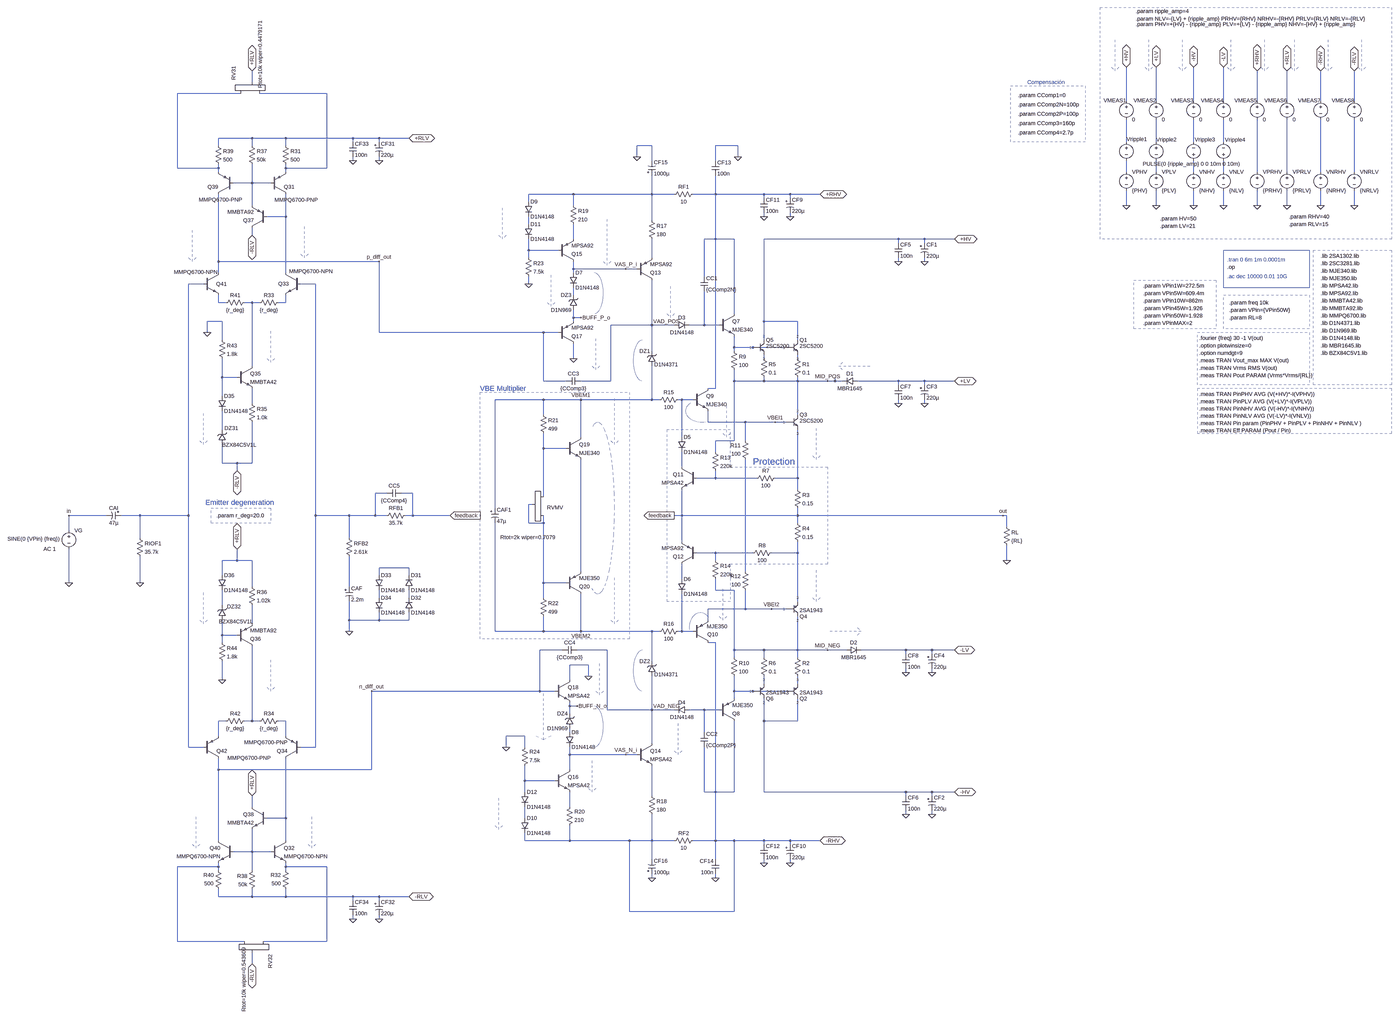
[diagram p0: schematic amplifier_V0.6 - Copy (2).asc, whole sheet]
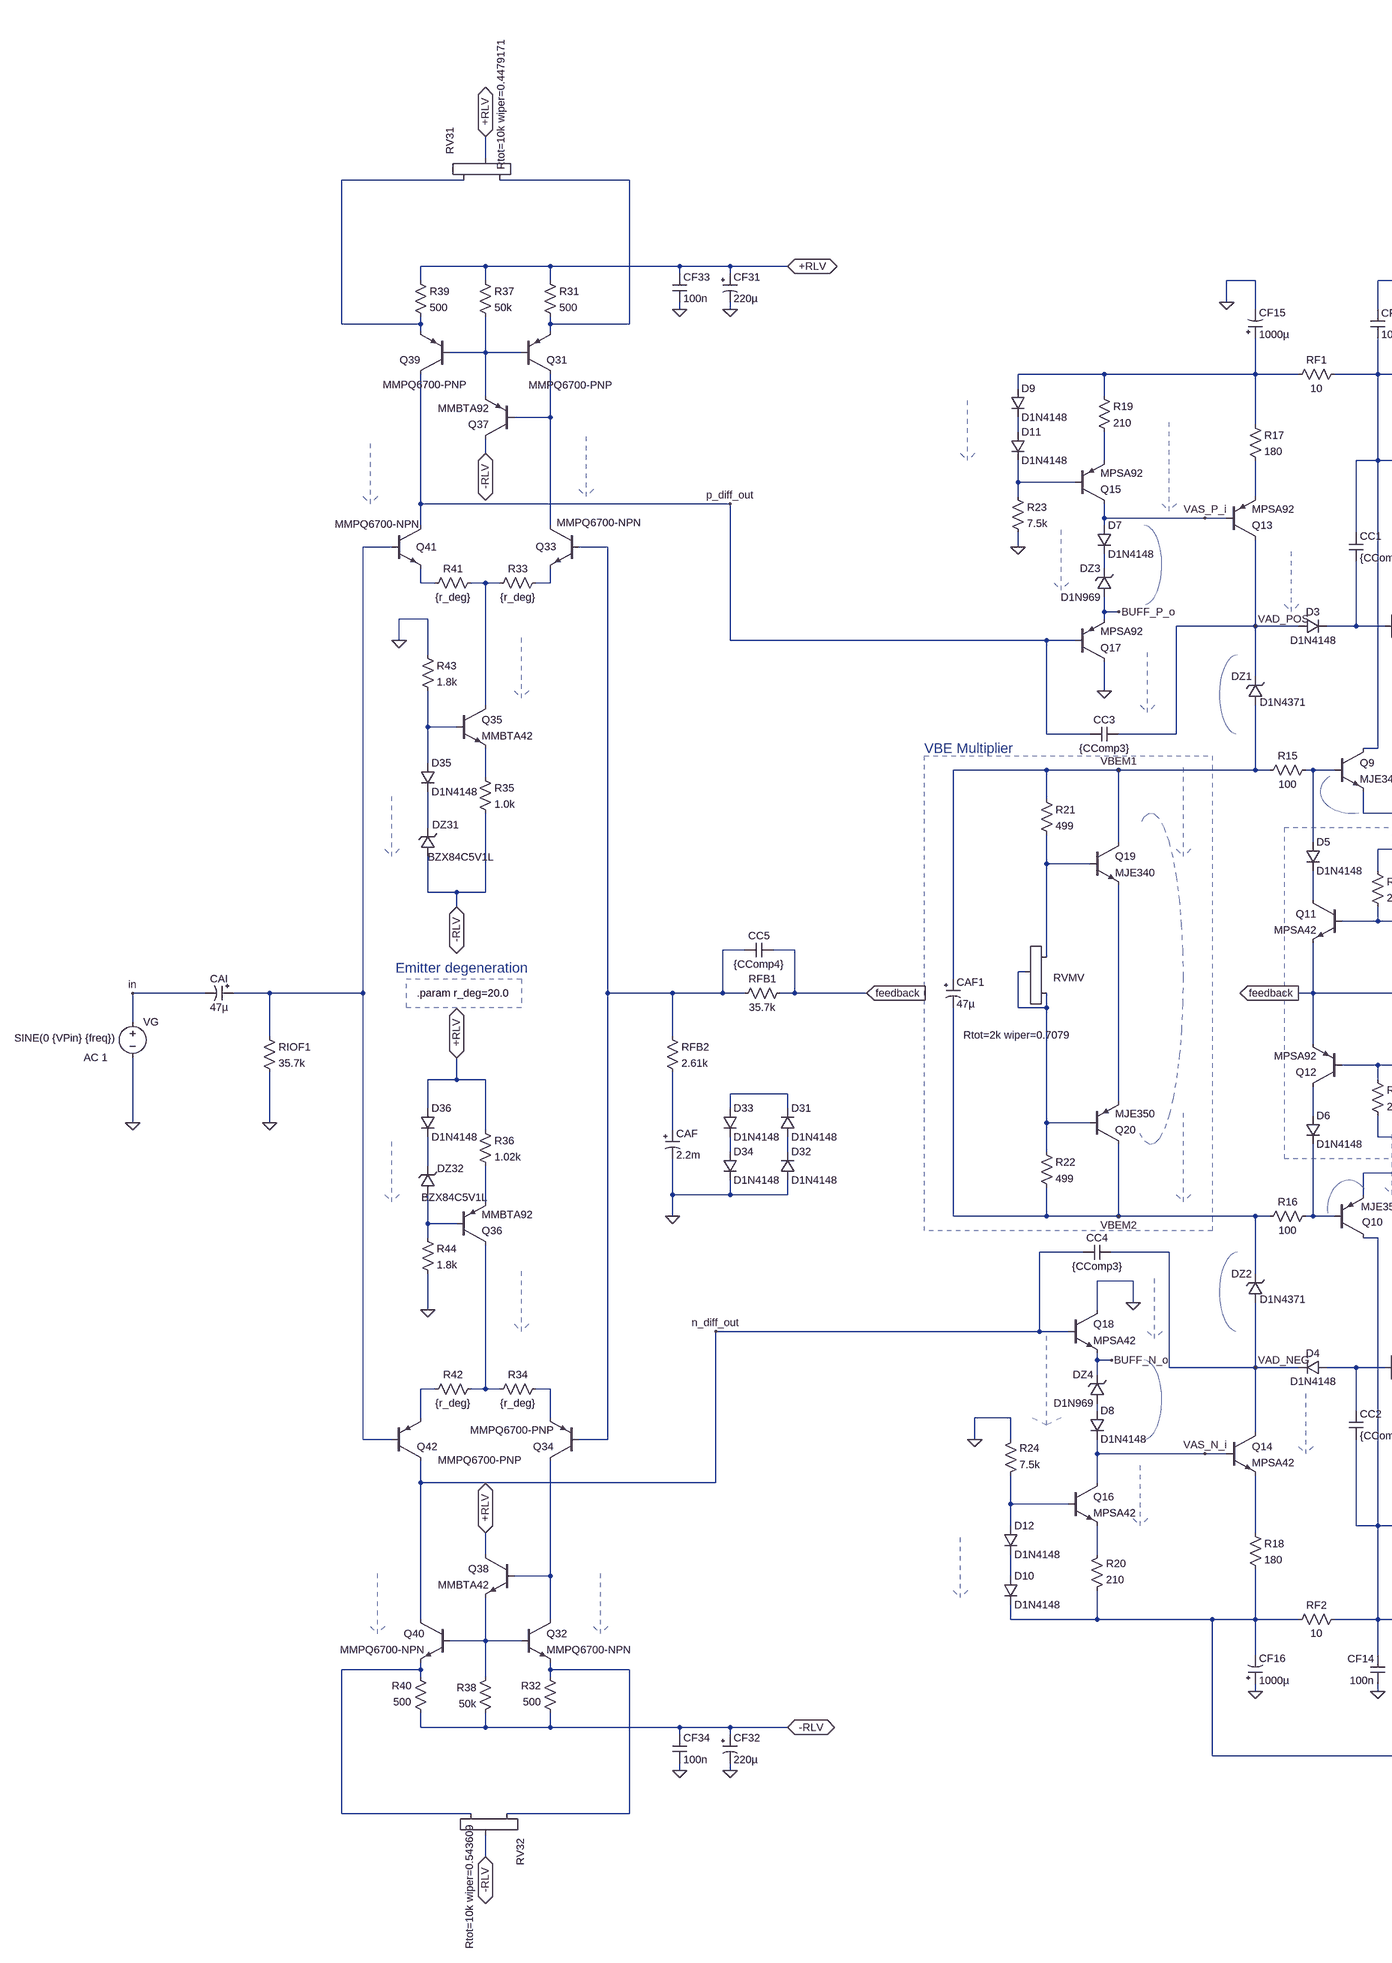
[diagram p1: schematic amplifier_V0.6 - Copy (2).asc, part, row 1 of 1, column 1 of 2]
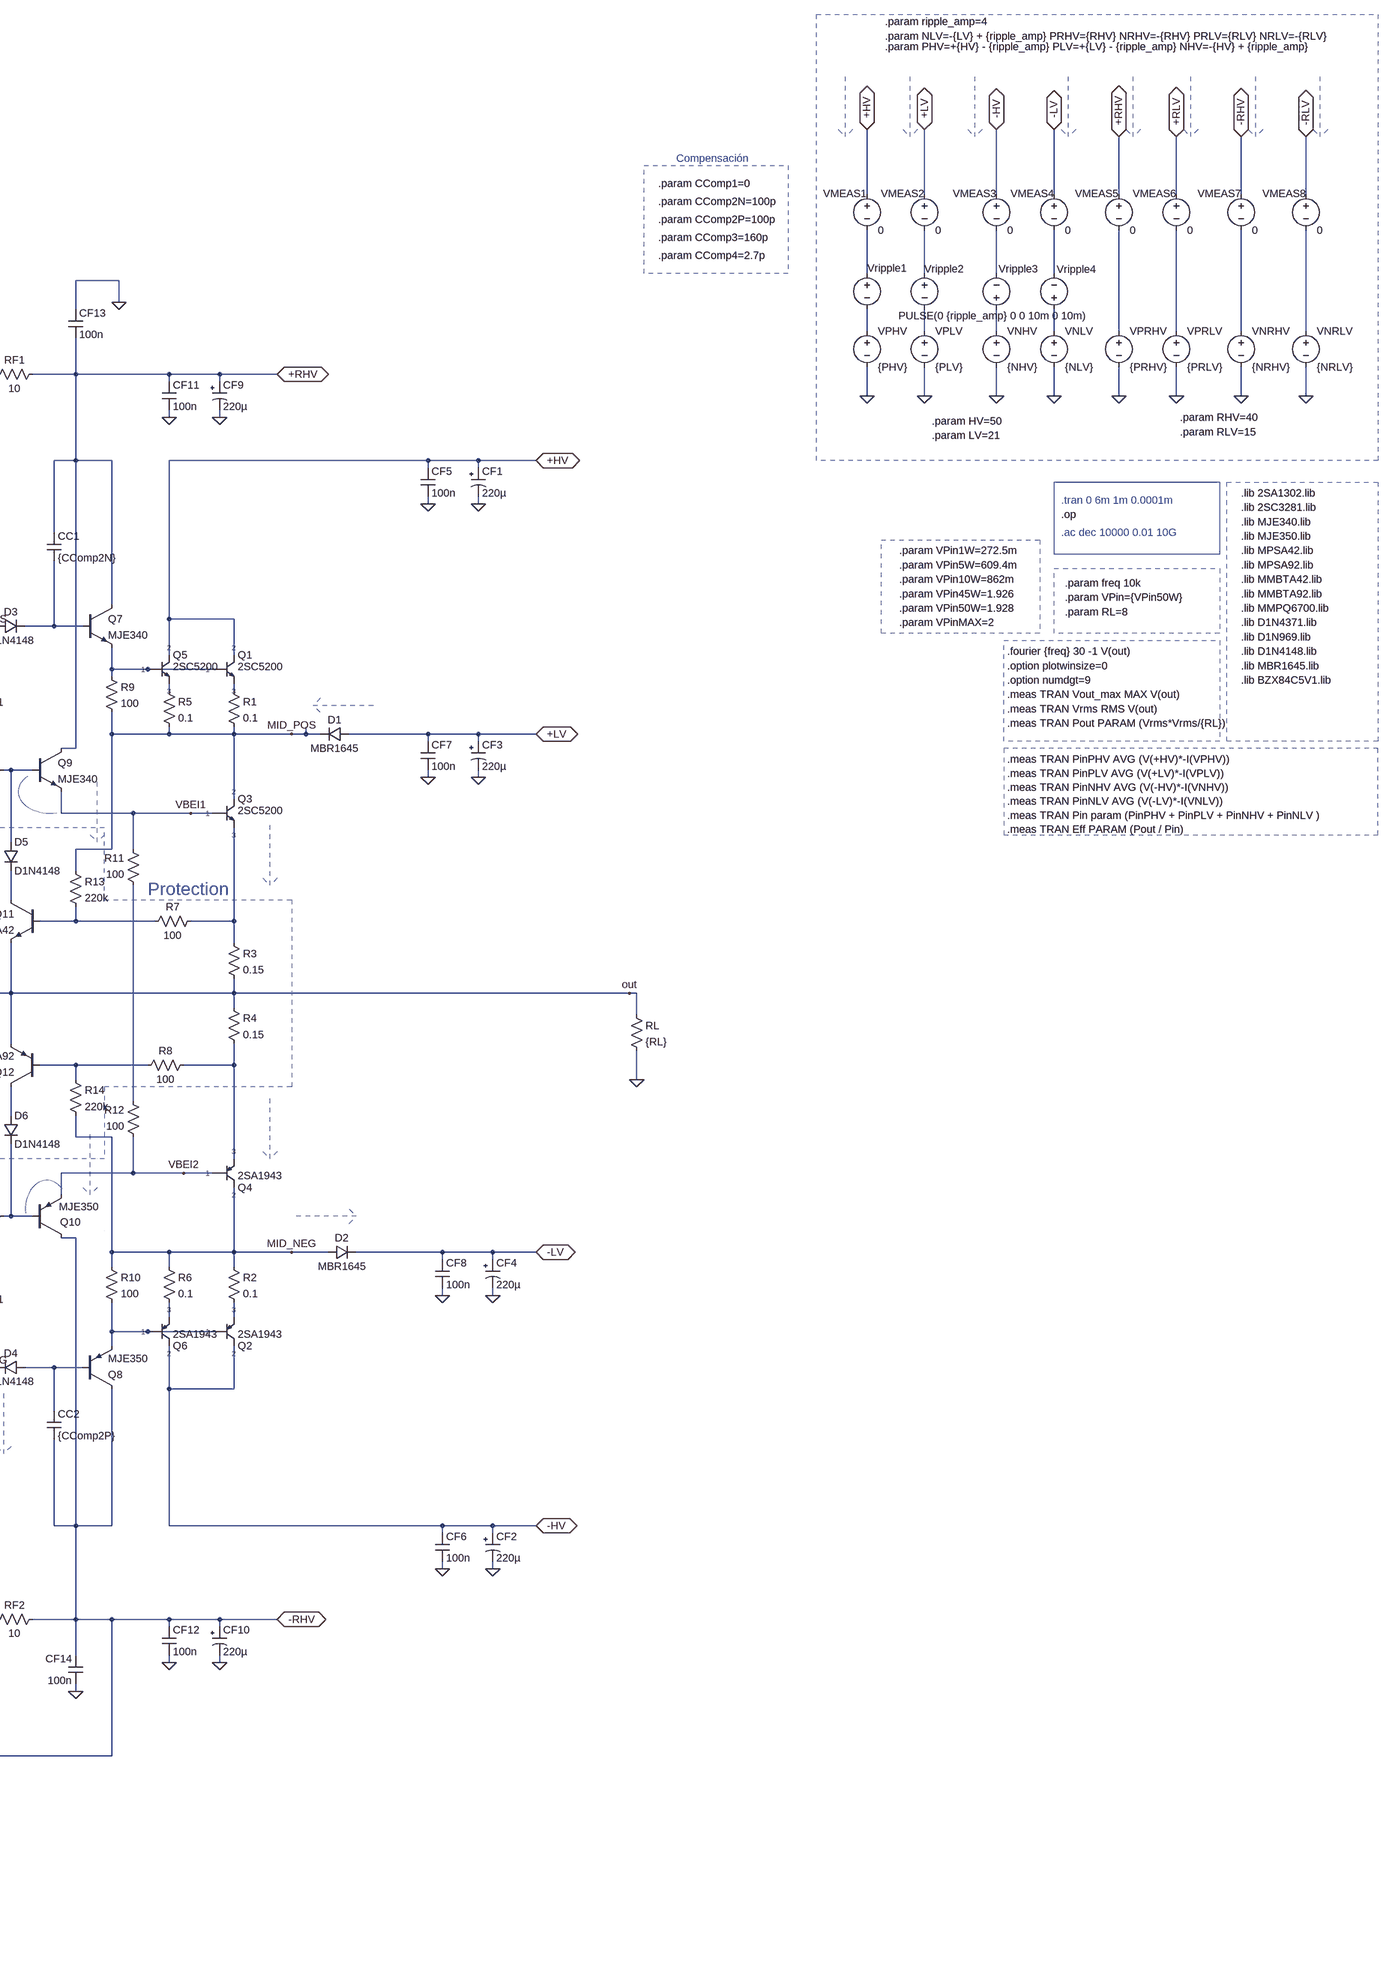
[diagram p2: schematic amplifier_V0.6 - Copy (2).asc, part, row 1 of 1, column 2 of 2]
amplifier_V0.6 - Copy (2).asc, the LTspice schematic file:
Version 4
SHEET 1 4212 2324
WIRE -2016 -1728 -2016 -1776
WIRE -2064 -1680 -2336 -1680
WIRE -1696 -1680 -1984 -1680
WIRE 1824 -1648 1824 -1792
WIRE 1952 -1648 1952 -1792
WIRE 2112 -1648 2112 -1792
WIRE 2240 -1648 2240 -1792
WIRE 2384 -1648 2384 -1776
WIRE 2512 -1648 2512 -1776
WIRE 2656 -1648 2656 -1776
WIRE 2800 -1648 2800 -1776
WIRE -2016 -1488 -2160 -1488
WIRE -1872 -1488 -2016 -1488
WIRE -1584 -1488 -1872 -1488
WIRE -1472 -1488 -1584 -1488
WIRE -1344 -1488 -1472 -1488
WIRE -1584 -1472 -1584 -1488
WIRE -1472 -1472 -1472 -1488
WIRE 1824 -1472 1824 -1568
WIRE 1952 -1472 1952 -1568
WIRE 2112 -1472 2112 -1568
WIRE 2240 -1472 2240 -1568
WIRE -2160 -1456 -2160 -1488
WIRE -2016 -1456 -2016 -1488
WIRE -1872 -1456 -1872 -1488
WIRE -304 -1456 -368 -1456
WIRE 64 -1456 -32 -1456
WIRE -368 -1408 -368 -1456
WIRE 64 -1408 64 -1456
WIRE -1584 -1392 -1584 -1408
WIRE -1472 -1392 -1472 -1408
WIRE -304 -1392 -304 -1456
WIRE -32 -1392 -32 -1456
WIRE -2336 -1360 -2336 -1680
WIRE -2160 -1360 -2160 -1376
WIRE -2160 -1360 -2336 -1360
WIRE -1872 -1360 -1872 -1376
WIRE -1696 -1360 -1696 -1680
WIRE -1696 -1360 -1872 -1360
WIRE -2160 -1344 -2160 -1360
WIRE -1872 -1344 -1872 -1360
WIRE 1824 -1344 1824 -1392
WIRE 1952 -1344 1952 -1392
WIRE 2112 -1344 2112 -1392
WIRE 2240 -1344 2240 -1392
WIRE 2384 -1344 2384 -1568
WIRE 2512 -1344 2512 -1568
WIRE 2656 -1344 2656 -1568
WIRE 2800 -1344 2800 -1568
WIRE -2016 -1296 -2016 -1376
WIRE -2016 -1296 -2096 -1296
WIRE -1936 -1296 -2016 -1296
WIRE -640 -1248 -832 -1248
WIRE -304 -1248 -304 -1328
WIRE -304 -1248 -640 -1248
WIRE -208 -1248 -304 -1248
WIRE -32 -1248 -32 -1328
WIRE -32 -1248 -128 -1248
WIRE 176 -1248 -32 -1248
WIRE 288 -1248 176 -1248
WIRE 416 -1248 288 -1248
WIRE 176 -1232 176 -1248
WIRE 288 -1232 288 -1248
WIRE -832 -1216 -832 -1248
WIRE -2016 -1200 -2016 -1296
WIRE -640 -1200 -640 -1248
WIRE 1824 -1200 1824 -1264
WIRE 1952 -1200 1952 -1264
WIRE 2112 -1200 2112 -1264
WIRE 2240 -1200 2240 -1264
WIRE 2384 -1200 2384 -1264
WIRE 2512 -1200 2512 -1264
WIRE 2656 -1200 2656 -1264
WIRE 2800 -1200 2800 -1264
WIRE -1872 -1152 -1872 -1248
WIRE -1872 -1152 -1952 -1152
WIRE 176 -1152 176 -1168
WIRE 288 -1152 288 -1168
WIRE -304 -1136 -304 -1248
WIRE -832 -1120 -832 -1152
WIRE -2016 -1072 -2016 -1104
WIRE -640 -1056 -640 -1120
WIRE -32 -1056 -32 -1248
WIRE -32 -1056 -80 -1056
WIRE 48 -1056 -32 -1056
WIRE 848 -1056 176 -1056
WIRE 960 -1056 848 -1056
WIRE 1088 -1056 960 -1056
WIRE 848 -1040 848 -1056
WIRE 960 -1040 960 -1056
WIRE -832 -1008 -832 -1056
WIRE -704 -1008 -832 -1008
WIRE -832 -976 -832 -1008
WIRE -304 -976 -304 -1056
WIRE -2160 -960 -2160 -1248
WIRE -1472 -960 -2160 -960
WIRE 848 -960 848 -976
WIRE 960 -960 960 -976
WIRE -640 -928 -640 -960
WIRE -416 -928 -640 -928
WIRE -368 -928 -416 -928
WIRE -2160 -912 -2160 -960
WIRE -1872 -912 -1872 -1152
WIRE -640 -912 -640 -928
WIRE -80 -896 -80 -1056
WIRE -2224 -864 -2288 -864
WIRE -1744 -864 -1808 -864
WIRE -832 -864 -832 -896
WIRE -640 -816 -640 -848
WIRE -2160 -784 -2160 -816
WIRE -2128 -784 -2160 -784
WIRE -2016 -784 -2048 -784
WIRE -1984 -784 -2016 -784
WIRE -1872 -784 -1872 -816
WIRE -1872 -784 -1904 -784
WIRE 48 -736 48 -1056
WIRE -640 -720 -640 -752
WIRE -608 -720 -640 -720
WIRE -2144 -704 -2208 -704
WIRE -640 -704 -640 -720
WIRE 176 -704 176 -1056
WIRE 320 -704 176 -704
WIRE -304 -688 -304 -880
WIRE -304 -688 -480 -688
WIRE -208 -688 -304 -688
WIRE -80 -688 -80 -832
WIRE -80 -688 -144 -688
WIRE -16 -688 -80 -688
WIRE -2208 -656 -2208 -704
WIRE -1472 -656 -1472 -960
WIRE -768 -656 -1472 -656
WIRE -704 -656 -768 -656
WIRE -2144 -624 -2144 -704
WIRE 176 -624 176 -704
WIRE 320 -624 320 -704
WIRE 48 -592 48 -640
WIRE 128 -592 48 -592
WIRE 272 -592 128 -592
WIRE -304 -576 -304 -688
WIRE 48 -576 48 -592
WIRE -640 -544 -640 -608
WIRE 176 -544 176 -560
WIRE 320 -544 320 -560
WIRE -2016 -512 -2016 -784
WIRE -2144 -464 -2144 -544
WIRE -2080 -464 -2144 -464
WIRE -768 -448 -768 -656
WIRE -672 -448 -768 -448
WIRE -480 -448 -480 -688
WIRE -480 -448 -608 -448
WIRE 48 -448 48 -496
WIRE 176 -448 176 -464
WIRE 176 -448 48 -448
WIRE 320 -448 320 -464
WIRE 320 -448 176 -448
WIRE 448 -448 320 -448
WIRE 480 -448 480 -464
WIRE 480 -448 448 -448
WIRE 512 -448 480 -448
WIRE 848 -448 576 -448
WIRE 960 -448 848 -448
WIRE 1088 -448 960 -448
WIRE 848 -432 848 -448
WIRE 960 -432 960 -448
WIRE -32 -416 -32 -1056
WIRE -32 -416 -64 -416
WIRE -2144 -384 -2144 -464
WIRE -768 -368 -976 -368
WIRE -608 -368 -768 -368
WIRE -304 -368 -304 -512
WIRE -304 -368 -608 -368
WIRE -272 -368 -304 -368
WIRE -176 -368 -192 -368
WIRE -128 -368 -176 -368
WIRE -2016 -352 -2016 -416
WIRE 848 -352 848 -368
WIRE 960 -352 960 -368
WIRE -768 -304 -768 -368
WIRE 320 -304 320 -448
WIRE -64 -272 -64 -320
WIRE 96 -272 -64 -272
WIRE 224 -272 96 -272
WIRE 272 -272 224 -272
WIRE -2144 -240 -2144 -320
WIRE -608 -208 -608 -368
WIRE -176 -208 -176 -368
WIRE 48 -192 48 -448
WIRE 48 -192 -32 -192
WIRE 96 -192 96 -272
WIRE -768 -160 -768 -224
WIRE -672 -160 -768 -160
WIRE -32 -144 -32 -192
WIRE -2144 -96 -2144 -176
WIRE -2080 -96 -2144 -96
WIRE -2016 -96 -2016 -272
WIRE -2016 -96 -2080 -96
WIRE -176 -80 -176 -144
WIRE -2080 -64 -2080 -96
WIRE -32 -32 -32 -64
WIRE -32 -32 -112 -32
WIRE 144 -32 -32 -32
WIRE 320 -32 320 -240
WIRE 320 -32 224 -32
WIRE 320 16 320 -32
WIRE -1440 32 -1488 32
WIRE -1328 32 -1376 32
WIRE -768 48 -768 -160
WIRE -816 80 -832 80
WIRE -976 96 -976 -368
WIRE -2640 128 -2912 128
WIRE -2496 128 -2576 128
WIRE -2288 128 -2288 -864
WIRE -2288 128 -2496 128
WIRE -1744 128 -1744 -864
WIRE -1600 128 -1744 128
WIRE -1488 128 -1488 32
WIRE -1488 128 -1600 128
WIRE -1440 128 -1488 128
WIRE -1328 128 -1328 32
WIRE -1328 128 -1360 128
WIRE -1168 128 -1328 128
WIRE -176 128 -176 16
WIRE -176 128 -208 128
WIRE 320 128 320 96
WIRE 320 128 -176 128
WIRE 1296 128 320 128
WIRE 1312 128 1296 128
WIRE -832 160 -832 80
WIRE -768 160 -768 128
WIRE -768 160 -832 160
WIRE 320 160 320 128
WIRE 1312 176 1312 128
WIRE -2912 192 -2912 128
WIRE -2496 224 -2496 128
WIRE -1600 224 -1600 128
WIRE -176 240 -176 128
WIRE -32 288 -112 288
WIRE 128 288 -32 288
WIRE 320 288 320 240
WIRE 320 288 208 288
WIRE -2080 320 -2080 272
WIRE -2080 320 -2144 320
WIRE -2016 320 -2080 320
WIRE -32 320 -32 288
WIRE 1312 320 1312 256
WIRE -1344 352 -1472 352
WIRE -608 368 -608 -112
WIRE 96 368 96 -112
WIRE -2144 384 -2144 320
WIRE -1472 384 -1472 352
WIRE -1344 384 -1344 352
WIRE -176 400 -176 336
WIRE -2912 416 -2912 272
WIRE -2496 416 -2496 304
WIRE -768 416 -768 160
WIRE -672 416 -768 416
WIRE -2016 432 -2016 320
WIRE -1600 432 -1600 304
WIRE -32 448 -32 400
WIRE 48 448 -32 448
WIRE -1472 480 -1472 448
WIRE -1344 480 -1344 448
WIRE -768 480 -768 416
WIRE 320 496 320 288
WIRE -2144 512 -2144 448
WIRE 96 528 96 448
WIRE 96 528 -64 528
WIRE 208 528 96 528
WIRE 272 528 208 528
WIRE -1600 576 -1600 496
WIRE -1472 576 -1472 544
WIRE -1472 576 -1600 576
WIRE -1344 576 -1344 544
WIRE -1344 576 -1472 576
WIRE -64 576 -64 528
WIRE -2016 592 -2016 512
WIRE -1600 624 -1600 576
WIRE -976 624 -976 160
WIRE -768 624 -768 560
WIRE -768 624 -976 624
WIRE -608 624 -608 464
WIRE -608 624 -768 624
WIRE -304 624 -608 624
WIRE -272 624 -304 624
WIRE -176 624 -176 464
WIRE -176 624 -192 624
WIRE -128 624 -176 624
WIRE -2144 640 -2144 576
WIRE -2080 640 -2144 640
WIRE -2144 672 -2144 640
WIRE -32 672 -64 672
WIRE -688 704 -784 704
WIRE -496 704 -624 704
WIRE 48 704 48 448
WIRE 176 704 48 704
WIRE 320 704 320 560
WIRE 320 704 176 704
WIRE 448 704 320 704
WIRE 528 704 448 704
WIRE 880 704 592 704
WIRE 992 704 880 704
WIRE 1088 704 992 704
WIRE 880 720 880 704
WIRE 992 720 992 704
WIRE 48 736 48 704
WIRE 176 736 176 704
WIRE 320 736 320 704
WIRE -304 752 -304 624
WIRE -576 768 -656 768
WIRE 880 800 880 784
WIRE 992 800 992 784
WIRE -576 816 -576 768
WIRE -2144 832 -2144 752
WIRE -656 832 -656 768
WIRE 176 848 176 816
WIRE 320 848 320 816
WIRE -784 880 -784 704
WIRE -784 880 -1504 880
WIRE -720 880 -784 880
WIRE 48 880 48 816
WIRE 128 880 48 880
WIRE 272 880 128 880
WIRE 48 912 48 880
WIRE -656 944 -656 928
WIRE -624 944 -656 944
WIRE -496 960 -496 704
WIRE -304 960 -304 816
WIRE -304 960 -496 960
WIRE -208 960 -304 960
WIRE -80 960 -144 960
WIRE -16 960 -80 960
WIRE -656 976 -656 944
WIRE -2128 1008 -2160 1008
WIRE -2016 1008 -2016 688
WIRE -2016 1008 -2048 1008
WIRE -1984 1008 -2016 1008
WIRE -1872 1008 -1904 1008
WIRE 176 1008 176 912
WIRE 320 1008 320 912
WIRE 320 1008 176 1008
WIRE -656 1056 -656 1040
WIRE -80 1056 -80 960
WIRE -2160 1072 -2160 1008
WIRE -1872 1072 -1872 1008
WIRE -848 1072 -928 1072
WIRE -304 1104 -304 960
WIRE -2288 1120 -2288 128
WIRE -2224 1120 -2288 1120
WIRE -1744 1120 -1744 128
WIRE -1744 1120 -1808 1120
WIRE -928 1120 -928 1072
WIRE -848 1120 -848 1072
WIRE -656 1152 -656 1120
WIRE -416 1152 -656 1152
WIRE -368 1152 -416 1152
WIRE -2160 1216 -2160 1168
WIRE -1504 1216 -1504 880
WIRE -1504 1216 -2160 1216
WIRE -656 1216 -656 1152
WIRE -848 1264 -848 1200
WIRE -720 1264 -848 1264
WIRE -848 1312 -848 1264
WIRE -80 1312 -80 1120
WIRE -32 1312 -32 672
WIRE -32 1312 -80 1312
WIRE 48 1312 48 1008
WIRE 48 1312 -32 1312
WIRE 176 1312 176 1008
WIRE 880 1312 176 1312
WIRE 992 1312 880 1312
WIRE 1088 1312 992 1312
WIRE -304 1328 -304 1200
WIRE 880 1328 880 1312
WIRE 992 1328 992 1312
WIRE -2016 1376 -2016 1328
WIRE -656 1376 -656 1312
WIRE 880 1408 880 1392
WIRE 992 1408 992 1392
WIRE -1872 1424 -1872 1168
WIRE -1872 1424 -1952 1424
WIRE -848 1424 -848 1376
WIRE -2160 1520 -2160 1216
WIRE -1872 1520 -1872 1424
WIRE -848 1520 -848 1488
WIRE -656 1520 -656 1456
WIRE -656 1520 -848 1520
WIRE -400 1520 -656 1520
WIRE -304 1520 -304 1408
WIRE -304 1520 -400 1520
WIRE -208 1520 -304 1520
WIRE -32 1520 -32 1312
WIRE -32 1520 -128 1520
WIRE 48 1520 -32 1520
WIRE 176 1520 48 1520
WIRE 288 1520 176 1520
WIRE 416 1520 288 1520
WIRE 176 1536 176 1520
WIRE 288 1536 288 1520
WIRE -2016 1568 -2016 1472
WIRE -2016 1568 -2096 1568
WIRE -1936 1568 -2016 1568
WIRE -304 1600 -304 1520
WIRE -32 1600 -32 1520
WIRE 176 1616 176 1600
WIRE 288 1616 288 1600
WIRE -2160 1632 -2160 1616
WIRE -2160 1632 -2336 1632
WIRE -1872 1632 -1872 1616
WIRE -1696 1632 -1872 1632
WIRE -2160 1648 -2160 1632
WIRE -2016 1648 -2016 1568
WIRE -1872 1648 -1872 1632
WIRE -304 1680 -304 1664
WIRE -32 1680 -32 1664
WIRE -2160 1760 -2160 1728
WIRE -2016 1760 -2016 1728
WIRE -2016 1760 -2160 1760
WIRE -1872 1760 -1872 1728
WIRE -1872 1760 -2016 1760
WIRE -1584 1760 -1872 1760
WIRE -1472 1760 -1584 1760
WIRE -1344 1760 -1472 1760
WIRE -1584 1776 -1584 1760
WIRE -1472 1776 -1472 1760
WIRE -400 1824 -400 1520
WIRE 48 1824 48 1520
WIRE 48 1824 -400 1824
WIRE -1584 1856 -1584 1840
WIRE -1472 1856 -1472 1840
WIRE -2336 1952 -2336 1632
WIRE -2048 1952 -2336 1952
WIRE -1696 1952 -1696 1632
WIRE -1696 1952 -1968 1952
WIRE -2016 2048 -2016 2000
FLAG -608 -368 VBEM1
FLAG -608 624 VBEM2
FLAG -304 -688 VAD_POS
FLAG -304 960 VAD_NEG
FLAG 448 704 MID_NEG
FLAG 448 -448 MID_POS
FLAG 224 -272 VBEI1
FLAG 208 528 VBEI2
FLAG -2496 416 0
FLAG -1600 624 0
FLAG -1344 -1488 +RLV
IOPIN -1344 -1488 BiDir
FLAG -1344 1760 -RLV
IOPIN -1344 1760 BiDir
FLAG -2016 1328 +RLV
IOPIN -2016 1328 BiDir
FLAG -2016 -1072 -RLV
IOPIN -2016 -1072 BiDir
FLAG -2080 -64 -RLV
IOPIN -2080 -64 BiDir
FLAG -2080 272 +RLV
IOPIN -2080 272 BiDir
FLAG 1088 1312 -HV
IOPIN 1088 1312 BiDir
FLAG 1088 704 -LV
IOPIN 1088 704 BiDir
FLAG 1088 -1056 +HV
IOPIN 1088 -1056 BiDir
FLAG 1088 -448 +LV
IOPIN 1088 -448 BiDir
FLAG 1312 320 0
FLAG 1296 128 out
FLAG -1168 128 feedback
IOPIN -1168 128 In
FLAG -208 128 feedback
IOPIN -208 128 Out
FLAG -2912 416 0
FLAG -2912 128 in
FLAG -416 -928 VAS_P_i
FLAG -608 -720 BUFF_P_o
FLAG -416 1152 VAS_N_i
FLAG -624 944 BUFF_N_o
FLAG 960 -960 0
FLAG -2016 -1776 +RLV
IOPIN -2016 -1776 BiDir
FLAG -2016 2048 -RLV
IOPIN -2016 2048 BiDir
FLAG 1824 -1200 0
FLAG 1952 -1200 0
FLAG 2112 -1200 0
FLAG 2240 -1200 0
FLAG 1824 -1792 +HV
IOPIN 1824 -1792 BiDir
FLAG 1952 -1792 +LV
IOPIN 1952 -1792 BiDir
FLAG 2112 -1792 -HV
IOPIN 2112 -1792 BiDir
FLAG 2240 -1792 -LV
IOPIN 2240 -1792 BiDir
FLAG 2384 -1200 0
FLAG 2656 -1200 0
FLAG 2384 -1776 +RHV
IOPIN 2384 -1776 BiDir
FLAG 2656 -1776 -RHV
IOPIN 2656 -1776 BiDir
FLAG 2512 -1200 0
FLAG 2512 -1776 +RLV
IOPIN 2512 -1776 BiDir
FLAG 2800 -1200 0
FLAG 2800 -1776 -RLV
IOPIN 2800 -1776 BiDir
FLAG 416 -1248 +RHV
IOPIN 416 -1248 BiDir
FLAG 416 1520 -RHV
IOPIN 416 1520 BiDir
FLAG -832 -864 0
FLAG -640 -544 0
FLAG -576 816 0
FLAG -928 1120 0
FLAG -2144 832 0
FLAG -2208 -656 0
FLAG -1472 -960 p_diff_out
FLAG -1504 880 n_diff_out
FLAG 848 -960 0
FLAG 960 -352 0
FLAG 848 -352 0
FLAG 992 800 0
FLAG 880 800 0
FLAG 992 1408 0
FLAG 880 1408 0
FLAG 288 -1152 0
FLAG 176 -1152 0
FLAG 288 1616 0
FLAG 176 1616 0
FLAG -1472 -1392 0
FLAG -1584 -1392 0
FLAG -1472 1856 0
FLAG -1584 1856 0
FLAG 64 -1408 0
FLAG -368 -1408 0
FLAG -304 1680 0
FLAG -32 1680 0
DATAFLAG 96 704 "round($*100)/100"
DATAFLAG -464 128 "V(vbem1)-V(vbem2)"
DATAFLAG -384 -496 "V(vad_pos)-V(vbem1)"
DATAFLAG -144 -288 "V(vbem1)-V(vbei1)"
DATAFLAG -144 576 "-(V(vbem2)-V(vbei2))"
DATAFLAG -464 624 ""
DATAFLAG -464 -368 ""
DATAFLAG -528 1152 ""
DATAFLAG -944 -656 ""
DATAFLAG -1008 880 ""
DATAFLAG -416 -688 ""
DATAFLAG -2016 -688 ""
DATAFLAG -2016 896 ""
DATAFLAG -2160 1328 ""
DATAFLAG -1872 1344 ""
DATAFLAG -2160 -1040 ""
DATAFLAG -1872 -1040 ""
DATAFLAG -2016 -1312 ""
DATAFLAG 1200 128 ""
DATAFLAG -2144 -480 ""
DATAFLAG -1632 128 ""
DATAFLAG -512 -800 "V(VAS_P_i)-V(BUFF_P_o)"
DATAFLAG 48 -592 ""
DATAFLAG -304 -1024 ""
DATAFLAG -368 960 ""
DATAFLAG -80 960 ""
DATAFLAG -768 976 "-Ie(Q16)"
DATAFLAG -608 80 ""
DATAFLAG -2128 640 ""
DATAFLAG -496 -1040 "-Ic(Q15)"
DATAFLAG -1248 128 ""
DATAFLAG 1024 -448 ""
DATAFLAG 1056 -1056 ""
DATAFLAG 1040 704 ""
DATAFLAG 384 -1248 ""
DATAFLAG -2016 -1088 ""
DATAFLAG -2096 -96 ""
DATAFLAG -2032 320 ""
DATAFLAG -1968 1760 ""
DATAFLAG -2016 1344 ""
DATAFLAG -832 -1008 ""
DATAFLAG -640 -720 ""
DATAFLAG -640 -1088 ""
DATAFLAG -736 -864 "I(D7)"
DATAFLAG -512 1056 "V(VAS_P_i)-V(BUFF_P_o)"
DATAFLAG -384 832 "-V(vad_neg)+V(vbem2)"
DATAFLAG -2016 1584 ""
DATAFLAG -832 -1248 ""
DATAFLAG -848 1520 ""
DATAFLAG -2416 128 ""
DATAFLAG -1744 1632 ""
DATAFLAG -2288 1632 ""
DATAFLAG 1056 1312 ""
DATAFLAG 1040 1312 ""
DATAFLAG 384 1520 ""
DATAFLAG -1376 -1488 ""
DATAFLAG -1376 1760 ""
DATAFLAG -944 -1152 "I(D9)"
DATAFLAG -224 -816 "-Ic(Q13)"
DATAFLAG 16 -288 "-Ie(Q9)"
DATAFLAG -464 -272 "Ic(Q19)"
DATAFLAG -464 496 "-Ic(Q20)"
DATAFLAG -768 -160 ""
DATAFLAG -768 416 ""
DATAFLAG 96 64 ""
DATAFLAG -112 128 ""
DATAFLAG 400 -208 "-Ix(Q3:3)"
DATAFLAG -544 -592 "-Ic(Q17)"
DATAFLAG -528 800 "Ic(Q18)"
DATAFLAG -560 1216 "Ic(Q16)"
DATAFLAG -960 1376 "I(D10)"
DATAFLAG -1792 -1072 "Ic(Q33)"
DATAFLAG -2272 -1056 "Ic(Q41)"
DATAFLAG -2224 -272 "I(D35)"
DATAFLAG -2224 496 "I(D36)"
DATAFLAG -1936 -624 "Ic(Q35)"
DATAFLAG -1936 784 "-Ic(Q36)"
DATAFLAG -1760 1456 "Ic(Q32)"
DATAFLAG -2256 1456 "Ic(Q40)"
DATAFLAG 1776 -1872 "-I(Vmeas1)"
DATAFLAG 2384 -1872 "-I(Vmeas5)"
DATAFLAG 1920 -1904 "-I(Vmeas2)"
DATAFLAG 2064 -1872 "-I(Vmeas3)"
DATAFLAG 2832 -1904 "-I(Vmeas8)"
DATAFLAG 2688 -1872 "-I(Vmeas7)"
DATAFLAG 2544 -1904 "-I(Vmeas6)"
DATAFLAG 2272 -1904 "-I(Vmeas4)"
DATAFLAG 400 400 "Ix(Q4:3)"
DATAFLAG -192 1056 "Ic(Q14)"
DATAFLAG 0 480 "Ie(Q10)"
DATAFLAG 592 -512 "I(D1)"
DATAFLAG 496 624 "I(D2)"
SYMBOL npn -16 -736 R0
SYMATTR InstName Q7
SYMATTR Value MJE340
SYMBOL res 32 -592 R0
SYMATTR InstName R9
SYMATTR Value 100
SYMBOL diode -208 -672 R270
WINDOW 0 32 32 VTop 2
WINDOW 3 0 32 VBottom 2
SYMATTR InstName D3
SYMATTR Value D1N4148
SYMBOL npn -128 -416 R0
SYMATTR InstName Q9
SYMATTR Value MJE340
SYMBOL res 304 0 R0
SYMATTR InstName R3
SYMATTR Value 0.15
SYMBOL res 112 -96 R180
WINDOW 0 36 76 Left 2
WINDOW 3 36 40 Left 2
SYMATTR InstName R11
SYMATTR Value 100
SYMBOL res 304 144 R0
SYMATTR InstName R4
SYMATTR Value 0.15
SYMBOL pnp -128 672 M180
WINDOW 0 61 35 Left 2
WINDOW 3 59 69 Left 2
SYMATTR InstName Q10
SYMATTR Value MJE350
SYMBOL pnp -16 1008 M180
SYMATTR InstName Q8
SYMATTR Value MJE350
SYMBOL diode -144 944 R90
WINDOW 0 0 32 VBottom 2
WINDOW 3 32 32 VTop 2
SYMATTR InstName D4
SYMATTR Value D1N4148
SYMBOL diode 528 720 R270
WINDOW 0 32 32 VTop 2
WINDOW 3 0 32 VBottom 2
SYMATTR InstName D2
SYMATTR Value MBR1645
SYMBOL res 112 464 R180
WINDOW 0 36 76 Left 2
WINDOW 3 36 40 Left 2
SYMATTR InstName R12
SYMATTR Value 100
SYMBOL res 304 720 R0
SYMATTR InstName R2
SYMATTR Value 0.1
SYMBOL res 160 720 R0
SYMATTR InstName R6
SYMATTR Value 0.1
SYMBOL res 160 -560 R0
SYMATTR InstName R5
SYMATTR Value 0.1
SYMBOL res 304 -560 R0
SYMATTR InstName R1
SYMATTR Value 0.1
SYMBOL diode 576 -432 M270
WINDOW 0 32 32 VTop 2
WINDOW 3 0 32 VBottom 2
SYMATTR InstName D1
SYMATTR Value MBR1645
SYMBOL pnp -672 464 M180
SYMATTR InstName Q20
SYMATTR Value MJE350
SYMBOL npn -672 -208 R0
SYMATTR InstName Q19
SYMATTR Value MJE340
SYMBOL res -784 -320 R0
SYMATTR InstName R21
SYMATTR Value 499
SYMBOL res -784 464 R0
SYMATTR InstName R22
SYMATTR Value 499
SYMBOL res -176 -384 R90
WINDOW 0 0 56 VBottom 2
WINDOW 3 32 56 VTop 2
SYMATTR InstName R15
SYMATTR Value 100
SYMBOL res -176 608 R90
WINDOW 0 0 56 VBottom 2
WINDOW 3 32 56 VTop 2
SYMATTR InstName R16
SYMATTR Value 100
SYMBOL pnp -368 -880 M180
SYMATTR InstName Q13
SYMATTR Value MPSA92
SYMBOL npn -368 1104 R0
SYMATTR InstName Q14
SYMATTR Value MPSA42
SYMBOL npn -720 832 R0
SYMATTR InstName Q18
SYMATTR Value MPSA42
SYMBOL res -1616 208 R0
SYMATTR InstName RFB2
SYMATTR Value 2.61k
SYMBOL res -1344 112 R90
WINDOW 0 0 56 VBottom 2
WINDOW 3 32 56 VTop 2
SYMATTR InstName RFB1
SYMATTR Value 35.7k
SYMBOL res -2512 208 R0
SYMATTR InstName RIOF1
SYMATTR Value 35.7k
SYMBOL pnp -704 -608 M180
SYMATTR InstName Q17
SYMATTR Value MPSA92
SYMBOL npn -2224 -912 R0
WINDOW 3 -127 -3 Left 2
WINDOW 0 54 48 Left 2
SYMATTR Value MMPQ6700-NPN
SYMATTR InstName Q41
SYMBOL npn -1808 -912 M0
WINDOW 0 50 47 Left 2
WINDOW 3 -138 -6 Left 2
SYMATTR InstName Q33
SYMATTR Value MMPQ6700-NPN
SYMBOL pnp -2224 1168 M180
WINDOW 3 102 2 Left 2
SYMATTR Value MMPQ6700-PNP
SYMATTR InstName Q42
SYMBOL pnp -1808 1168 R180
SYMATTR InstName Q34
SYMATTR Value MMPQ6700-PNP
SYMBOL cap -608 -464 R90
WINDOW 0 0 32 VBottom 2
WINDOW 3 32 32 VTop 2
SYMATTR InstName CC3
SYMATTR Value {CComp3}
SYMBOL cap -624 688 R90
WINDOW 0 0 32 VBottom 2
WINDOW 3 32 32 VTop 2
SYMATTR InstName CC4
SYMATTR Value {CComp3}
SYMBOL pnp -1936 -1248 M180
WINDOW 3 16 -24 Left 2
SYMATTR Value MMPQ6700-PNP
SYMATTR InstName Q31
SYMBOL pnp -2096 -1248 R180
WINDOW 0 65 32 Left 2
WINDOW 3 -38 -23 Left 2
SYMATTR InstName Q39
SYMATTR Value MMPQ6700-PNP
SYMBOL npn -2096 1520 M0
SYMATTR InstName Q40
SYMATTR Value MMPQ6700-NPN
SYMBOL npn -1936 1520 R0
SYMATTR InstName Q32
SYMATTR Value MMPQ6700-NPN
SYMBOL res -320 -1152 R0
SYMATTR InstName R17
SYMATTR Value 180
SYMBOL res -320 1312 R0
SYMATTR InstName R18
SYMATTR Value 180
SYMBOL res -2176 -1472 R0
SYMATTR InstName R39
SYMATTR Value 500
SYMBOL res -1888 -1472 R0
SYMATTR InstName R31
SYMATTR Value 500
SYMBOL res -1856 1744 R180
WINDOW 0 36 76 Left 2
WINDOW 3 36 40 Left 2
SYMATTR InstName R32
SYMATTR Value 500
SYMBOL res -2144 1744 R180
WINDOW 0 36 76 Left 2
WINDOW 3 36 40 Left 2
SYMATTR InstName R40
SYMATTR Value 500
SYMBOL npn -1952 1376 M0
SYMATTR InstName Q38
SYMATTR Value MMBTA42
SYMBOL pnp -1952 -1104 R180
SYMATTR InstName Q37
SYMATTR Value MMBTA92
SYMBOL res -2000 1632 M0
SYMATTR InstName R38
SYMATTR Value 50k
SYMBOL res -2032 -1472 R0
SYMATTR InstName R37
SYMATTR Value 50k
SYMBOL 2SC5200 144 -608 R0
SYMATTR InstName Q5
SYMBOL 2SC5200 288 -608 R0
SYMATTR InstName Q1
SYMBOL 2SC5200 288 -288 R0
SYMATTR InstName Q3
SYMBOL 2SA1943 288 544 M180
SYMATTR InstName Q4
SYMBOL 2SA1943 144 896 M180
SYMATTR InstName Q6
SYMBOL 2SA1943 288 896 M180
SYMATTR InstName Q2
SYMBOL res -2160 -640 R0
SYMATTR InstName R43
SYMATTR Value 1.8k
SYMBOL npn -2080 -512 R0
SYMATTR InstName Q35
SYMATTR Value MMBTA42
SYMBOL res -2032 -368 R0
SYMATTR InstName R35
SYMATTR Value 1.0k
SYMBOL pnp -2080 688 M180
SYMATTR InstName Q36
SYMATTR Value MMBTA92
SYMBOL res -2032 416 R0
SYMATTR InstName R36
SYMATTR Value 1.02k
SYMBOL res -2160 656 R0
SYMATTR InstName R44
SYMATTR Value 1.8k
SYMBOL res 1296 160 R0
SYMATTR InstName RL
SYMATTR Value {RL}
SYMBOL cap -96 1056 R0
SYMATTR InstName CC2
SYMATTR Value {CComp2P}
SYMBOL cap -96 -896 R0
SYMATTR InstName CC1
SYMATTR Value {CComp2N}
SYMBOL voltage -2912 176 R0
WINDOW 3 -263 52 Left 2
WINDOW 123 -109 95 Left 2
WINDOW 39 0 0 Left 2
SYMATTR Value SINE(0 {VPin} {freq})
SYMATTR Value2 AC 1
SYMATTR InstName VG
SYMBOL zener -624 -752 R180
WINDOW 0 24 64 Left 2
WINDOW 3 24 0 Left 2
SYMATTR InstName DZ3
SYMATTR Value D1N969
SYMBOL zener -640 1040 R180
WINDOW 0 24 64 Left 2
WINDOW 3 24 0 Left 2
SYMATTR InstName DZ4
SYMATTR Value D1N969
SYMBOL zener -288 -512 R180
WINDOW 0 24 64 Left 2
WINDOW 3 -96 7 Left 2
SYMATTR InstName DZ1
SYMATTR Value D1N4371
SYMBOL zener -288 816 R180
WINDOW 0 24 64 Left 2
WINDOW 3 -96 7 Left 2
SYMATTR InstName DZ2
SYMATTR Value D1N4371
SYMBOL cap 832 -1040 R0
SYMATTR InstName CF5
SYMATTR Value 100n
SYMBOL zener -2128 -176 R180
WINDOW 0 -53 70 Left 2
WINDOW 3 -131 -1 Left 2
SYMATTR InstName DZ31
SYMATTR Value BZX84C5V1L
SYMATTR Prefix X
SYMBOL zener -2128 576 R180
WINDOW 0 -64 58 Left 2
WINDOW 3 -117 -6 Left 2
SYMATTR InstName DZ32
SYMATTR Value BZX84C5V1L
SYMATTR Prefix X
SYMBOL potentiometer_standard -1952 1936 R90
WINDOW 3 39 99 Left 2
SYMATTR Value Rtot=10k wiper=0.543609
SYMATTR InstName RV32
SYMATTR SpiceLine ""
SYMBOL potentiometer_standard -2080 -1664 R270
WINDOW 3 39 99 Left 2
SYMATTR Value Rtot=10k wiper=0.4479171
SYMATTR InstName RV31
SYMATTR SpiceLine ""
SYMBOL cap -1376 16 R90
WINDOW 0 0 32 VBottom 2
WINDOW 3 32 32 VTop 2
SYMATTR InstName CC5
SYMATTR Value {CComp4}
SYMBOL voltage 1824 -1360 R0
SYMATTR InstName VPHV
SYMATTR Value {PHV}
SYMBOL voltage 1952 -1360 R0
SYMATTR InstName VPLV
SYMATTR Value {PLV}
SYMBOL voltage 2112 -1360 R0
SYMATTR InstName VNHV
SYMATTR Value {NHV}
SYMBOL voltage 2240 -1360 R0
SYMATTR InstName VNLV
SYMATTR Value {NLV}
SYMBOL voltage 2384 -1360 R0
SYMATTR InstName VPRHV
SYMATTR Value {PRHV}
SYMBOL voltage 2656 -1360 R0
SYMATTR InstName VNRHV
SYMATTR Value {NRHV}
SYMBOL voltage 2512 -1360 R0
SYMATTR InstName VPRLV
SYMATTR Value {PRLV}
SYMBOL voltage 2800 -1360 R0
SYMATTR InstName VNRLV
SYMATTR Value {NRLV}
SYMBOL pnp -704 -960 M180
SYMATTR InstName Q15
SYMATTR Value MPSA92
SYMBOL res -656 -1216 R0
SYMATTR InstName R19
SYMATTR Value 210
SYMBOL res -848 -992 R0
SYMATTR InstName R23
SYMATTR Value 7.5k
SYMBOL res -672 1472 M180
WINDOW 0 36 76 Left 2
WINDOW 3 36 40 Left 2
SYMATTR InstName R20
SYMATTR Value 210
SYMBOL res -864 1216 M180
WINDOW 0 36 76 Left 2
WINDOW 3 36 40 Left 2
SYMATTR InstName R24
SYMATTR Value 7.5k
SYMBOL npn -720 1216 R0
SYMATTR InstName Q16
SYMATTR Value MPSA42
SYMBOL diode -864 1312 R0
SYMATTR InstName D12
SYMATTR Value D1N4148
SYMBOL diode -864 1424 R0
SYMATTR InstName D10
SYMATTR Value D1N4148
SYMBOL diode -848 -1216 R0
SYMATTR InstName D9
SYMATTR Value D1N4148
SYMBOL diode -848 -1120 R0
SYMATTR InstName D11
SYMATTR Value D1N4148
SYMBOL diode -656 -912 R0
SYMATTR InstName D7
SYMATTR Value D1N4148
SYMBOL diode -672 1056 R0
SYMATTR InstName D8
SYMATTR Value D1N4148
SYMBOL potentiometer_standard -752 144 R180
WINDOW 3 -36 -77 Left 2
WINDOW 0 -68 50 Left 2
WINDOW 38 50 -51 Left 2
SYMATTR Value Rtot=2k wiper=0.7079
SYMATTR InstName RVMV
SYMATTR SpiceLine ""
SYMBOL diode -2160 384 R0
SYMATTR InstName D36
SYMATTR Value D1N4148
SYMBOL diode -2160 -384 R0
SYMATTR InstName D35
SYMATTR Value D1N4148
SYMBOL voltage 2240 -1376 R180
WINDOW 123 0 0 Left 0
WINDOW 39 0 0 Left 0
WINDOW 0 -94 105 Left 2
WINDOW 3 24 96 Invisible 2
SYMATTR InstName Vripple4
SYMATTR Value PULSE(0 {ripple_amp} 0 0 10m 0 10m)
SYMBOL voltage 2112 -1376 R180
WINDOW 123 0 0 Left 0
WINDOW 39 0 0 Left 0
WINDOW 0 -93 106 Left 2
WINDOW 3 24 96 Invisible 2
SYMATTR InstName Vripple3
SYMATTR Value PULSE(0 {ripple_amp} 0 0 10m 0 10m)
SYMBOL voltage 1824 -1488 R0
WINDOW 123 0 0 Left 0
WINDOW 39 0 0 Left 0
WINDOW 0 1 4 Left 2
WINDOW 3 70 110 Left 2
SYMATTR InstName Vripple1
SYMATTR Value PULSE(0 {ripple_amp} 0 0 10m 0 10m)
SYMBOL voltage 1952 -1488 R0
WINDOW 123 0 0 Left 0
WINDOW 39 0 0 Left 0
WINDOW 0 0 6 Left 2
WINDOW 3 24 96 Invisible 2
SYMATTR InstName Vripple2
SYMATTR Value PULSE(0 {ripple_amp} 0 0 10m 0 10m)
SYMBOL pnp -112 336 R180
SYMATTR InstName Q12
SYMATTR Value MPSA92
SYMBOL npn -112 -80 M0
SYMATTR InstName Q11
SYMATTR Value MPSA42
SYMBOL diode -192 -208 R0
SYMATTR InstName D5
SYMATTR Value D1N4148
SYMBOL res 240 -48 R90
WINDOW 0 0 56 VBottom 2
WINDOW 3 32 56 VTop 2
SYMATTR InstName R7
SYMATTR Value 100
SYMBOL res 224 272 R90
WINDOW 0 0 56 VBottom 2
WINDOW 3 32 56 VTop 2
SYMATTR InstName R8
SYMATTR Value 100
SYMBOL diode -192 400 R0
SYMATTR InstName D6
SYMATTR Value D1N4148
SYMBOL res -48 -160 R0
SYMATTR InstName R13
SYMATTR Value 220k
SYMBOL res -48 304 R0
SYMATTR InstName R14
SYMATTR Value 220k
SYMBOL res -2032 -800 R90
WINDOW 0 0 56 VBottom 2
WINDOW 3 32 56 VTop 2
SYMATTR InstName R41
SYMATTR Value {r_deg}
SYMBOL res -1888 -800 R90
WINDOW 0 0 56 VBottom 2
WINDOW 3 32 56 VTop 2
SYMATTR InstName R33
SYMATTR Value {r_deg}
SYMBOL res -2032 992 R90
WINDOW 0 0 56 VBottom 2
WINDOW 3 32 56 VTop 2
SYMATTR InstName R42
SYMATTR Value {r_deg}
SYMBOL res -1888 992 R90
WINDOW 0 0 56 VBottom 2
WINDOW 3 32 56 VTop 2
SYMATTR InstName R34
SYMATTR Value {r_deg}
SYMBOL polcap 944 -1040 R0
SYMATTR InstName CF1
SYMATTR Value 220µ
SYMBOL cap 832 -432 R0
SYMATTR InstName CF7
SYMATTR Value 100n
SYMBOL polcap 944 -432 R0
SYMATTR InstName CF3
SYMATTR Value 220µ
SYMBOL cap 864 720 R0
SYMATTR InstName CF8
SYMATTR Value 100n
SYMBOL polcap 976 720 R0
SYMATTR InstName CF4
SYMATTR Value 220µ
SYMBOL cap 864 1328 R0
SYMATTR InstName CF6
SYMATTR Value 100n
SYMBOL polcap 976 1328 R0
SYMATTR InstName CF2
SYMATTR Value 220µ
SYMBOL cap 160 -1232 R0
SYMATTR InstName CF11
SYMATTR Value 100n
SYMBOL polcap 272 -1232 R0
SYMATTR InstName CF9
SYMATTR Value 220µ
SYMBOL cap 160 1536 R0
SYMATTR InstName CF12
SYMATTR Value 100n
SYMBOL polcap 272 1536 R0
SYMATTR InstName CF10
SYMATTR Value 220µ
SYMBOL cap -1600 -1472 R0
SYMATTR InstName CF33
SYMATTR Value 100n
SYMBOL polcap -1488 -1472 R0
SYMATTR InstName CF31
SYMATTR Value 220µ
SYMBOL cap -1600 1776 R0
SYMATTR InstName CF34
SYMATTR Value 100n
SYMBOL polcap -1488 1776 R0
SYMATTR InstName CF32
SYMATTR Value 220µ
SYMBOL polcap -1616 432 R0
SYMATTR InstName CAF
SYMATTR Value 2.2m
SYMBOL res -224 -1232 R270
WINDOW 0 32 56 VTop 2
WINDOW 3 0 56 VBottom 2
SYMATTR InstName RF1
SYMATTR Value 10
SYMBOL cap -48 -1328 M180
WINDOW 0 24 56 Left 2
WINDOW 3 24 8 Left 2
SYMATTR InstName CF13
SYMATTR Value 100n
SYMBOL polcap -320 -1328 M180
WINDOW 0 24 57 Left 2
WINDOW 3 24 8 Left 2
SYMATTR InstName CF15
SYMATTR Value 1000µ
SYMBOL res -112 1504 R90
WINDOW 0 0 56 VBottom 2
WINDOW 3 32 56 VTop 2
SYMATTR InstName RF2
SYMATTR Value 10
SYMBOL cap -16 1600 M0
SYMATTR InstName CF14
SYMATTR Value 100n
SYMBOL polcap -320 1664 M180
WINDOW 0 24 57 Left 2
WINDOW 3 24 8 Left 2
SYMATTR InstName CF16
SYMATTR Value 1000µ
SYMBOL diode -1488 384 R0
SYMATTR InstName D33
SYMATTR Value D1N4148
SYMBOL diode -1488 480 R0
SYMATTR InstName D34
SYMATTR Value D1N4148
SYMBOL diode -1360 544 M180
WINDOW 0 24 64 Left 2
WINDOW 3 24 0 Left 2
SYMATTR InstName D32
SYMATTR Value D1N4148
SYMBOL diode -1360 448 M180
WINDOW 0 24 64 Left 2
WINDOW 3 24 0 Left 2
SYMATTR InstName D31
SYMATTR Value D1N4148
SYMBOL polcap -2576 112 R90
WINDOW 0 0 32 VBottom 2
WINDOW 3 32 32 VTop 2
SYMATTR InstName CAI
SYMATTR Value 47µ
SYMBOL voltage 1824 -1664 R0
WINDOW 0 -97 14 Left 2
SYMATTR InstName VMEAS1
SYMATTR Value 0
SYMBOL voltage 1952 -1664 R0
WINDOW 0 -97 14 Left 2
SYMATTR InstName VMEAS2
SYMATTR Value 0
SYMBOL voltage 2112 -1664 R0
WINDOW 0 -97 14 Left 2
SYMATTR InstName VMEAS3
SYMATTR Value 0
SYMBOL voltage 2240 -1664 R0
WINDOW 0 -97 14 Left 2
SYMATTR InstName VMEAS4
SYMATTR Value 0
SYMBOL voltage 2384 -1664 R0
WINDOW 0 -97 14 Left 2
SYMATTR InstName VMEAS5
SYMATTR Value 0
SYMBOL voltage 2512 -1664 R0
WINDOW 0 -97 14 Left 2
SYMATTR InstName VMEAS6
SYMATTR Value 0
SYMBOL voltage 2656 -1664 R0
WINDOW 0 -97 14 Left 2
SYMATTR InstName VMEAS7
SYMATTR Value 0
SYMBOL voltage 2800 -1664 R0
WINDOW 0 -97 14 Left 2
SYMATTR InstName VMEAS8
SYMATTR Value 0
SYMBOL res 32 720 R0
SYMATTR InstName R10
SYMATTR Value 100
SYMBOL polcap -992 96 R0
SYMATTR InstName CAF1
SYMATTR Value 47µ
TEXT 2256 -968 Left 2 ;.tran 0 6m 1m 0.0001m
TEXT 2264 -784 Left 2 !.param freq 10k
TEXT 2256 -936 Left 2 !.op
TEXT 2136 -632 Left 2 !.fourier {freq} 30 -1 V(out)
TEXT 2656 -984 Left 2 !.lib 2SA1302.lib
TEXT 2656 -952 Left 2 !.lib 2SC3281.lib
TEXT 2656 -696 Left 2 !.lib D1N4371.lib
TEXT 2656 -600 Left 2 !.lib MBR1645.lib
TEXT 2656 -920 Left 2 !.lib MJE340.lib
TEXT 2656 -888 Left 2 !.lib MJE350.lib
TEXT 2656 -632 Left 2 !.lib D1N4148.lib
TEXT 2656 -856 Left 2 !.lib MPSA42.lib
TEXT 2656 -824 Left 2 !.lib MPSA92.lib
TEXT 2656 -664 Left 2 !.lib D1N969.lib
TEXT 2256 -896 Left 2 ;.ac dec 10000 0.01 10G
TEXT 2264 -752 Left 2 !.param VPin={VPin50W}
TEXT 2656 -568 Left 2 !.lib BZX84C5V1.lib
TEXT 2656 -792 Left 2 !.lib MMBTA42.lib
TEXT 2656 -760 Left 2 !.lib MMBTA92.lib
TEXT 2656 -728 Left 2 !.lib MMPQ6700.lib
TEXT 2136 -600 Left 2 !.option plotwinsize=0
TEXT 2136 -504 Left 2 !.meas TRAN Vrms RMS V(out)
TEXT 2136 -472 Left 2 !.meas TRAN Pout PARAM (Vrms*Vrms/{RL})
TEXT 2136 -568 Left 2 !.option numdgt=9
TEXT 2136 -536 Left 2 !.meas TRAN Vout_max MAX V(out)
TEXT 2264 -720 Left 2 !.param RL=8
TEXT 2136 -392 Left 2 !.meas TRAN PinPHV AVG (V(+HV)*-I(VPHV))\n.meas TRAN PinPLV AVG (V(+LV)*-I(VPLV))\n.meas TRAN PinNHV AVG (V(-HV)*-I(VNHV))\n.meas TRAN PinNLV AVG (V(-LV)*-I(VNLV))\n.meas TRAN Pin param (PinPHV + PinPLV + PinNHV + PinNLV )\n.meas TRAN Eff PARAM (Pout / Pin)
TEXT 1360 -1672 Left 2 !.param CComp1=0
TEXT 1360 -1632 Left 2 !.param CComp2N=100p
TEXT 1360 -1552 Left 2 !.param CComp3=160p
TEXT 1400 -1728 Left 2 ;Compensación
TEXT 1360 -1592 Left 2 !.param CComp2P=100p
TEXT 1360 -1512 Left 2 !.param CComp4=2.7p
TEXT 1864 -1976 Left 2 !.param PHV=+{HV} - {ripple_amp} PLV=+{LV} - {ripple_amp} NHV=-{HV} + {ripple_amp}
TEXT 1968 -1144 Left 2 !.param HV=50
TEXT 1968 -1112 Left 2 !.param LV=21
TEXT 2520 -1152 Left 2 !.param RHV=40
TEXT 2520 -1120 Left 2 !.param RLV=15
TEXT -1040 -416 Left 3 ;VBE Multiplier
TEXT -2168 128 Left 2 !.param r_deg=20.0
TEXT 128 -104 Left 4 ;Protection
TEXT -2216 72 Left 3 ;Emitter degeneration
TEXT 1896 -856 Left 2 !.param VPin1W=272.5m
TEXT 1896 -696 Left 2 !.param VPinMAX=2
TEXT 1864 -2032 Left 2 !.param ripple_amp=4
TEXT 1896 -824 Left 2 !.param VPin5W=609.4m
TEXT 1896 -792 Left 2 !.param VPin10W=862m
TEXT 1896 -760 Left 2 !.param VPin45W=1.926
TEXT 1896 -728 Left 2 !.param VPin50W=1.928
TEXT 1864 -2000 Left 2 !.param NLV=-{LV} + {ripple_amp} PRHV={RHV} NRHV=-{RHV} PRLV={RLV} NRLV=-{RLV}
LINE Normal -768 1088 -768 880 2
LINE Normal -736 1072 -768 1088 2
LINE Normal -800 1072 -768 1088 2
LINE Normal -496 -944 -496 -1152 2
LINE Normal -496 -944 -496 -944 2
LINE Normal -496 -944 -496 -944 2
LINE Normal -512 -960 -496 -944 2
LINE Normal -512 -960 -512 -960 2
LINE Normal -480 -960 -496 -944 2
LINE Normal -736 -768 -736 -912 2
LINE Normal -736 -768 -736 -768 2
LINE Normal -736 -768 -736 -768 2
LINE Normal -752 -784 -736 -768 2
LINE Normal -752 -784 -752 -784 2
LINE Normal -720 -784 -736 -768 2
LINE Normal 32 496 -240 496 2
LINE Normal 32 336 32 496 2
LINE Normal 448 336 32 336 2
LINE Normal 448 -80 448 336 2
LINE Normal 32 -80 448 -80 2
LINE Normal -240 -240 -240 496 2
LINE Normal 32 -240 -240 -240 2
LINE Normal 32 -80 32 -240 2
LINE Normal 32 -80 32 -80 2
LINE Normal -944 -1056 -944 -1200 2
LINE Normal -944 -1056 -944 -1056 2
LINE Normal -944 -1056 -944 -1056 2
LINE Normal -960 -1072 -944 -1056 2
LINE Normal -960 -1072 -960 -1072 2
LINE Normal -928 -1072 -944 -1056 2
LINE Normal -224 -720 -224 -720 2
LINE Normal -224 -720 -224 -720 2
LINE Normal -240 -736 -224 -720 2
LINE Normal -240 -736 -240 -736 2
LINE Normal -208 -736 -224 -720 2
LINE Normal 16 -208 16 -352 2
LINE Normal 16 -208 16 -208 2
LINE Normal 16 -208 16 -208 2
LINE Normal 0 -224 16 -208 2
LINE Normal 0 -224 0 -224 2
LINE Normal 32 -224 16 -208 2
LINE Normal -464 -176 -464 -384 2
LINE Normal -464 -176 -464 -176 2
LINE Normal -464 -176 -464 -176 2
LINE Normal -480 -192 -464 -176 2
LINE Normal -480 -192 -480 -192 2
LINE Normal -448 -192 -464 -176 2
LINE Normal -464 592 -464 384 2
LINE Normal -464 592 -464 592 2
LINE Normal -464 592 -464 592 2
LINE Normal -480 576 -464 592 2
LINE Normal -480 576 -480 576 2
LINE Normal -448 576 -464 592 2
LINE Normal 48 672 48 672 2
LINE Normal 48 672 48 672 2
LINE Normal 32 656 32 656 2
LINE Normal 400 -112 400 -256 2
LINE Normal 400 -112 400 -112 2
LINE Normal 400 -112 400 -112 2
LINE Normal 384 -128 400 -112 2
LINE Normal 384 -128 384 -128 2
LINE Normal 416 -128 400 -112 2
LINE Normal -544 -496 -544 -640 2
LINE Normal -544 -496 -544 -496 2
LINE Normal -544 -496 -544 -496 2
LINE Normal -560 -512 -544 -496 2
LINE Normal -560 -512 -560 -512 2
LINE Normal -528 -512 -544 -496 2
LINE Normal -528 896 -528 752 2
LINE Normal -528 896 -528 896 2
LINE Normal -528 896 -528 896 2
LINE Normal -544 880 -528 896 2
LINE Normal -544 880 -544 880 2
LINE Normal -512 880 -528 896 2
LINE Normal -560 1312 -560 1168 2
LINE Normal -560 1312 -560 1312 2
LINE Normal -560 1312 -560 1312 2
LINE Normal -576 1296 -560 1312 2
LINE Normal -576 1296 -576 1296 2
LINE Normal -544 1296 -560 1312 2
LINE Normal -960 1472 -960 1328 2
LINE Normal -960 1472 -960 1472 2
LINE Normal -960 1472 -960 1472 2
LINE Normal -976 1456 -960 1472 2
LINE Normal -976 1456 -976 1456 2
LINE Normal -944 1456 -960 1472 2
LINE Normal -1792 -976 -1792 -1120 2
LINE Normal -1792 -976 -1792 -976 2
LINE Normal -1792 -976 -1792 -976 2
LINE Normal -1808 -992 -1792 -976 2
LINE Normal -1808 -992 -1808 -992 2
LINE Normal -1776 -992 -1792 -976 2
LINE Normal -2272 -960 -2272 -1104 2
LINE Normal -2272 -960 -2272 -960 2
LINE Normal -2272 -960 -2272 -960 2
LINE Normal -2288 -976 -2272 -960 2
LINE Normal -2288 -976 -2288 -976 2
LINE Normal -2256 -976 -2272 -960 2
LINE Normal -2224 -176 -2224 -320 2
LINE Normal -2224 -176 -2224 -176 2
LINE Normal -2224 -176 -2224 -176 2
LINE Normal -2240 -192 -2224 -176 2
LINE Normal -2240 -192 -2240 -192 2
LINE Normal -2208 -192 -2224 -176 2
LINE Normal -2224 592 -2224 448 2
LINE Normal -2224 592 -2224 592 2
LINE Normal -2224 592 -2224 592 2
LINE Normal -2240 576 -2224 592 2
LINE Normal -2240 576 -2240 576 2
LINE Normal -2208 576 -2224 592 2
LINE Normal -1936 -528 -1936 -672 2
LINE Normal -1936 -528 -1936 -528 2
LINE Normal -1936 -528 -1936 -528 2
LINE Normal -1952 -544 -1936 -528 2
LINE Normal -1952 -544 -1952 -544 2
LINE Normal -1920 -544 -1936 -528 2
LINE Normal -1936 880 -1936 736 2
LINE Normal -1936 880 -1936 880 2
LINE Normal -1936 880 -1936 880 2
LINE Normal -1952 864 -1936 880 2
LINE Normal -1952 864 -1952 864 2
LINE Normal -1920 864 -1936 880 2
LINE Normal -1760 1552 -1760 1408 2
LINE Normal -1760 1552 -1760 1552 2
LINE Normal -1760 1552 -1760 1552 2
LINE Normal -1776 1536 -1760 1552 2
LINE Normal -1776 1536 -1776 1536 2
LINE Normal -1744 1536 -1760 1552 2
LINE Normal -2256 1552 -2256 1408 2
LINE Normal -2256 1552 -2256 1552 2
LINE Normal -2256 1552 -2256 1552 2
LINE Normal -2272 1536 -2256 1552 2
LINE Normal -2272 1536 -2272 1536 2
LINE Normal -2240 1536 -2256 1552 2
LINE Normal 1776 -1776 1776 -1920 2
LINE Normal 1776 -1776 1776 -1776 2
LINE Normal 1776 -1776 1776 -1776 2
LINE Normal 1760 -1792 1776 -1776 2
LINE Normal 1760 -1792 1760 -1792 2
LINE Normal 1792 -1792 1776 -1776 2
LINE Normal 2416 -1776 2416 -1920 2
LINE Normal 2416 -1776 2416 -1776 2
LINE Normal 2416 -1776 2416 -1776 2
LINE Normal 2400 -1792 2416 -1776 2
LINE Normal 2400 -1792 2400 -1792 2
LINE Normal 2432 -1792 2416 -1776 2
LINE Normal 1920 -1776 1920 -1920 2
LINE Normal 1920 -1776 1920 -1776 2
LINE Normal 1920 -1776 1920 -1776 2
LINE Normal 1904 -1792 1920 -1776 2
LINE Normal 1904 -1792 1904 -1792 2
LINE Normal 1936 -1792 1920 -1776 2
LINE Normal 2064 -1776 2064 -1920 2
LINE Normal 2064 -1776 2064 -1776 2
LINE Normal 2064 -1776 2064 -1776 2
LINE Normal 2048 -1792 2064 -1776 2
LINE Normal 2048 -1792 2048 -1792 2
LINE Normal 2080 -1792 2064 -1776 2
LINE Normal 2832 -1776 2832 -1920 2
LINE Normal 2832 -1776 2832 -1776 2
LINE Normal 2832 -1776 2832 -1776 2
LINE Normal 2816 -1792 2832 -1776 2
LINE Normal 2816 -1792 2816 -1792 2
LINE Normal 2848 -1792 2832 -1776 2
LINE Normal 2688 -1776 2688 -1920 2
LINE Normal 2688 -1776 2688 -1776 2
LINE Normal 2688 -1776 2688 -1776 2
LINE Normal 2672 -1792 2688 -1776 2
LINE Normal 2672 -1792 2672 -1792 2
LINE Normal 2704 -1792 2688 -1776 2
LINE Normal 2544 -1776 2544 -1920 2
LINE Normal 2544 -1776 2544 -1776 2
LINE Normal 2544 -1776 2544 -1776 2
LINE Normal 2528 -1792 2544 -1776 2
LINE Normal 2528 -1792 2528 -1792 2
LINE Normal 2560 -1792 2544 -1776 2
LINE Normal 2272 -1776 2272 -1920 2
LINE Normal 2272 -1776 2272 -1776 2
LINE Normal 2272 -1776 2272 -1776 2
LINE Normal 2256 -1792 2272 -1776 2
LINE Normal 2256 -1792 2256 -1792 2
LINE Normal 2288 -1792 2272 -1776 2
LINE Normal 400 496 400 352 2
LINE Normal 400 496 400 496 2
LINE Normal 400 496 400 496 2
LINE Normal 384 480 400 496 2
LINE Normal 384 480 384 480 2
LINE Normal 416 480 400 496 2
LINE Normal -224 -720 -224 -864 2
LINE Normal -192 1152 -192 1152 2
LINE Normal -192 1152 -192 1152 2
LINE Normal -208 1136 -192 1152 2
LINE Normal -208 1136 -208 1136 2
LINE Normal -176 1136 -192 1152 2
LINE Normal -192 1152 -192 1008 2
LINE Normal 16 496 16 496 2
LINE Normal 16 496 16 496 2
LINE Normal 0 480 0 480 2
LINE Normal 0 576 0 432 2
LINE Normal 0 576 0 576 2
LINE Normal 0 576 0 576 2
LINE Normal -16 560 0 576 2
LINE Normal -16 560 -16 560 2
LINE Normal 16 560 0 576 2
LINE Normal 496 -512 640 -512 2
LINE Normal 496 -512 496 -512 2
LINE Normal 496 -512 496 -512 2
LINE Normal 512 -528 496 -512 2
LINE Normal 512 -528 512 -528 2
LINE Normal 512 -496 496 -512 2
LINE Normal 592 624 448 624 2
LINE Normal 592 624 592 624 2
LINE Normal 592 624 592 624 2
LINE Normal 576 640 592 624 2
LINE Normal 576 640 576 640 2
LINE Normal 576 608 592 624 2
RECTANGLE Normal 2608 -848 2240 -1008
RECTANGLE Normal 2608 -672 2240 -816 3
RECTANGLE Normal 2960 -432 2624 -1008 2
RECTANGLE Normal 2608 -432 2128 -656 3
RECTANGLE Normal 2128 -224 2960 -416 3
RECTANGLE Normal 1648 -1472 1328 -1712 1
RECTANGLE Normal 2960 -1056 1712 -2048 4
RECTANGLE Normal -400 656 -1040 -400 3
RECTANGLE Normal -1936 160 -2192 96 2
RECTANGLE Normal 2208 -672 1856 -880 3
ARC Normal -160 -368 -16 -272 -157 -366 -64 -237 3
ARC Normal -608 -272 -464 464 -563 453 -565 -267 2
ARC Normal -304 -624 -384 -448 -344 -632 -348 -442 2
ARC Normal -592 -912 -512 -736 -548 -730 -552 -920 2
ARC Normal -592 944 -512 1120 -548 1126 -552 936 2
ARC Normal -304 704 -384 880 -344 696 -348 886 2
ARC Normal -48 544 -144 672 -50 547 -179 624 3

The netlist it stands for:
* amplifier_V0.6 - Copy (2).asc
Q7 +RHV N028 N029 0 MJE340
R9 N029 MID_POS 100
D3 VAD_POS N028 D1N4148
Q9 +RHV N033 VBEI1 0 MJE340
R3 N039 feedback 0.15
R11 N045 VBEI1 100
R4 feedback N042 0.15
Q10 -RHV N052 VBEI2 0 MJE350
Q8 -RHV N057 N056 0 MJE350
D4 N057 VAD_NEG D1N4148
D2 MID_NEG -LV MBR1645
R12 VBEI2 N045 100
R2 MID_NEG N055 0.1
R6 MID_NEG N054 0.1
R5 N030 MID_POS 0.1
R1 N031 MID_POS 0.1
D1 +LV MID_POS MBR1645
Q20 VBEM2 N040 N044 0 MJE350
Q19 VBEM1 N036 N044 0 MJE340
R21 VBEM1 N036 499
R22 N040 VBEM2 499
R15 N033 VBEM1 100
R16 N052 VBEM2 100
Q13 VAD_POS VAS_P_i N021 0 MPSA92
Q14 VAD_NEG VAS_N_i N063 0 MPSA42
Q18 0 n_diff_out BUFF_N_o 0 MPSA42
RFB2 N023 N047 2.61k
RFB1 feedback N023 35.7k
RIOF1 N022 0 35.7k
Q17 0 p_diff_out BUFF_P_o 0 MPSA92
Q41 p_diff_out N022 N025 0 MMPQ6700-NPN
Q33 N017 N023 N027 0 MMPQ6700-NPN
Q42 n_diff_out N022 N058 0 MMPQ6700-PNP
Q34 N065 N023 N060 0 MMPQ6700-PNP
CC3 VAD_POS p_diff_out {CComp3}
CC4 VAD_NEG n_diff_out {CComp3}
Q31 N017 N015 N002 0 MMPQ6700-PNP
Q39 p_diff_out N015 N001 0 MMPQ6700-PNP
Q40 n_diff_out N067 N068 0 MMPQ6700-NPN
Q32 N065 N067 N069 0 MMPQ6700-NPN
R17 N016 N021 180
R18 N063 -RHV 180
R39 +RLV N001 500
R31 +RLV N002 500
R32 -RLV N069 500
R40 -RLV N068 500
Q38 +RLV N065 N067 0 MMBTA42
Q37 -RLV N017 N015 0 MMBTA92
R38 N067 -RLV 50k
R37 +RLV N015 50k
XQ5 +HV N029 N030 2SC5200  ; pins 2 1 3
XQ1 +HV N029 N031 2SC5200  ; pins 2 1 3
XQ3 MID_POS VBEI1 N039 2SC5200  ; pins 2 1 3
XQ4 MID_NEG VBEI2 N042 2SA1943  ; pins 2 1 3
XQ6 -HV N056 N054 2SA1943  ; pins 2 1 3
XQ2 -HV N056 N055 2SA1943  ; pins 2 1 3
R43 0 N032 1.8k
Q35 N026 N032 N034 0 MMBTA42
R35 N034 -RLV 1.0k
Q36 N059 N053 N051 0 MMBTA92
R36 +RLV N051 1.02k
R44 N053 0 1.8k
RL feedback 0 {RL}
CC2 N057 -RHV {CComp2P}
CC1 +RHV N028 {CComp2N}
VG in 0 SINE(0 {VPin} {freq}) AC 1
DZ3 BUFF_P_o N024 D1N969
DZ4 N061 BUFF_N_o D1N969
DZ1 VBEM1 VAD_POS D1N4371
DZ2 VAD_NEG VBEM2 D1N4371
CF5 +HV 0 100n
XDZ31 -RLV N035 BZX84C5V1L  ; pins + -
XDZ32 N053 N050 BZX84C5V1L  ; pins + -
XRV32 N069 N068 -RLV Rtot=10k wiper=0.543609
XRV31 N001 N002 +RLV Rtot=10k wiper=0.4479171
CC5 feedback N023 {CComp4}
VPHV N007 0 {PHV}
VPLV N008 0 {PLV}
VNHV N009 0 {NHV}
VNLV N010 0 {NLV}
VPRHV N011 0 {PRHV}
VNRHV N013 0 {NRHV}
VPRLV N012 0 {PRLV}
VNRLV N014 0 {NRLV}
Q15 VAS_P_i N020 N019 0 MPSA92
R19 N016 N019 210
R23 N020 0 7.5k
R20 -RHV N064 210
R24 N062 0 7.5k
Q16 VAS_N_i N062 N064 0 MPSA42
D12 N062 N066 D1N4148
D10 N066 -RHV D1N4148
D9 N016 N018 D1N4148
D11 N018 N020 D1N4148
D7 VAS_P_i N024 D1N4148
D8 N061 VAS_N_i D1N4148
XRVMV N040 N036 N040 Rtot=2k wiper=0.7079
D36 +RLV N050 D1N4148
D35 N032 N035 D1N4148
Vripple4 N010 N006 PULSE(0 {ripple_amp} 0 0 10m 0 10m)
Vripple3 N009 N005 PULSE(0 {ripple_amp} 0 0 10m 0 10m)
Vripple1 N003 N007 PULSE(0 {ripple_amp} 0 0 10m 0 10m)
Vripple2 N004 N008 PULSE(0 {ripple_amp} 0 0 10m 0 10m)
Q12 N046 N041 feedback 0 MPSA92
Q11 N037 N038 feedback 0 MPSA42
D5 N033 N037 D1N4148
R7 N039 N038 100
R8 N042 N041 100
D6 N046 N052 D1N4148
R13 MID_POS N038 220k
R14 N041 MID_NEG 220k
R41 N026 N025 {r_deg}
R33 N027 N026 {r_deg}
R42 N059 N058 {r_deg}
R34 N060 N059 {r_deg}
CF1 +HV 0 220µ
CF7 +LV 0 100n
CF3 +LV 0 220µ
CF8 -LV 0 100n
CF4 -LV 0 220µ
CF6 -HV 0 100n
CF2 -HV 0 220µ
CF11 +RHV 0 100n
CF9 +RHV 0 220µ
CF12 -RHV 0 100n
CF10 -RHV 0 220µ
CF33 +RLV 0 100n
CF31 +RLV 0 220µ
CF34 -RLV 0 100n
CF32 -RLV 0 220µ
CAF N047 0 2.2m
RF1 N016 +RHV 10
CF13 +RHV 0 100n
CF15 N016 0 1000µ
RF2 -RHV -RHV 10
CF14 -RHV 0 100n
CF16 0 -RHV 1000µ
D33 N043 N048 D1N4148
D34 N048 0 D1N4148
D32 0 N049 D1N4148
D31 N049 N043 D1N4148
CAI N022 in 47µ
VMEAS1 +HV N003 0
VMEAS2 +LV N004 0
VMEAS3 -HV N005 0
VMEAS4 -LV N006 0
VMEAS5 +RHV N011 0
VMEAS6 +RLV N012 0
VMEAS7 -RHV N013 0
VMEAS8 -RLV N014 0
R10 MID_NEG N056 100
CAF1 VBEM1 VBEM2 47µ
.model D D
.lib standard.dio
.model NPN NPN
.model PNP PNP
.lib standard.bjt
* .tran 0 6m 1m 0.0001m
.param freq 10k
.op
.fourier {freq} 30 -1 V(out)
.lib 2SA1302.lib
.lib 2SC3281.lib
.lib D1N4371.lib
.lib MBR1645.lib
.lib MJE340.lib
.lib MJE350.lib
.lib D1N4148.lib
.lib MPSA42.lib
.lib MPSA92.lib
.lib D1N969.lib
* .ac dec 10000 0.01 10G
.param VPin={VPin50W}
.lib BZX84C5V1.lib
.lib MMBTA42.lib
.lib MMBTA92.lib
.lib MMPQ6700.lib
.option plotwinsize=0
.meas TRAN Vrms RMS V(out)
.meas TRAN Pout PARAM (Vrms*Vrms/{RL})
.option numdgt=9
.meas TRAN Vout_max MAX V(out)
.param RL=8
.meas TRAN PinPHV AVG (V(+HV)*-I(VPHV))
.meas TRAN PinPLV AVG (V(+LV)*-I(VPLV))
.meas TRAN PinNHV AVG (V(-HV)*-I(VNHV))
.meas TRAN PinNLV AVG (V(-LV)*-I(VNLV))
.meas TRAN Pin param (PinPHV + PinPLV + PinNHV + PinNLV )
.meas TRAN Eff PARAM (Pout / Pin)
.param CComp1=0
.param CComp2N=100p
.param CComp3=160p
* Compensación
.param CComp2P=100p
.param CComp4=2.7p
.param PHV=+{HV} - {ripple_amp} PLV=+{LV} - {ripple_amp} NHV=-{HV} + {ripple_amp}
.param HV=50
.param LV=21
.param RHV=40
.param RLV=15
* VBE Multiplier
.param r_deg=20.0
* Protection
* Emitter degeneration
.param VPin1W=272.5m
.param VPinMAX=2
.param ripple_amp=4
.param VPin5W=609.4m
.param VPin10W=862m
.param VPin45W=1.926
.param VPin50W=1.928
.param NLV=-{LV} + {ripple_amp} PRHV={RHV} NRHV=-{RHV} PRLV={RLV} NRLV=-{RLV}
.lib 2SC5200.mod
.lib 2SA1943.mod
.backanno
.end